# Altium schematic sheet pca20053_sheet5_sensors_and_leds.SchDoc: Thingy:53 Sensors and LEDs
size A3; Organization: Nordic Semiconductor; DocumentNumber: 5; SheetNumber: 5; SheetTotal: 6; CompanyName: Nordic Semiconductor; DocumentSize: A3
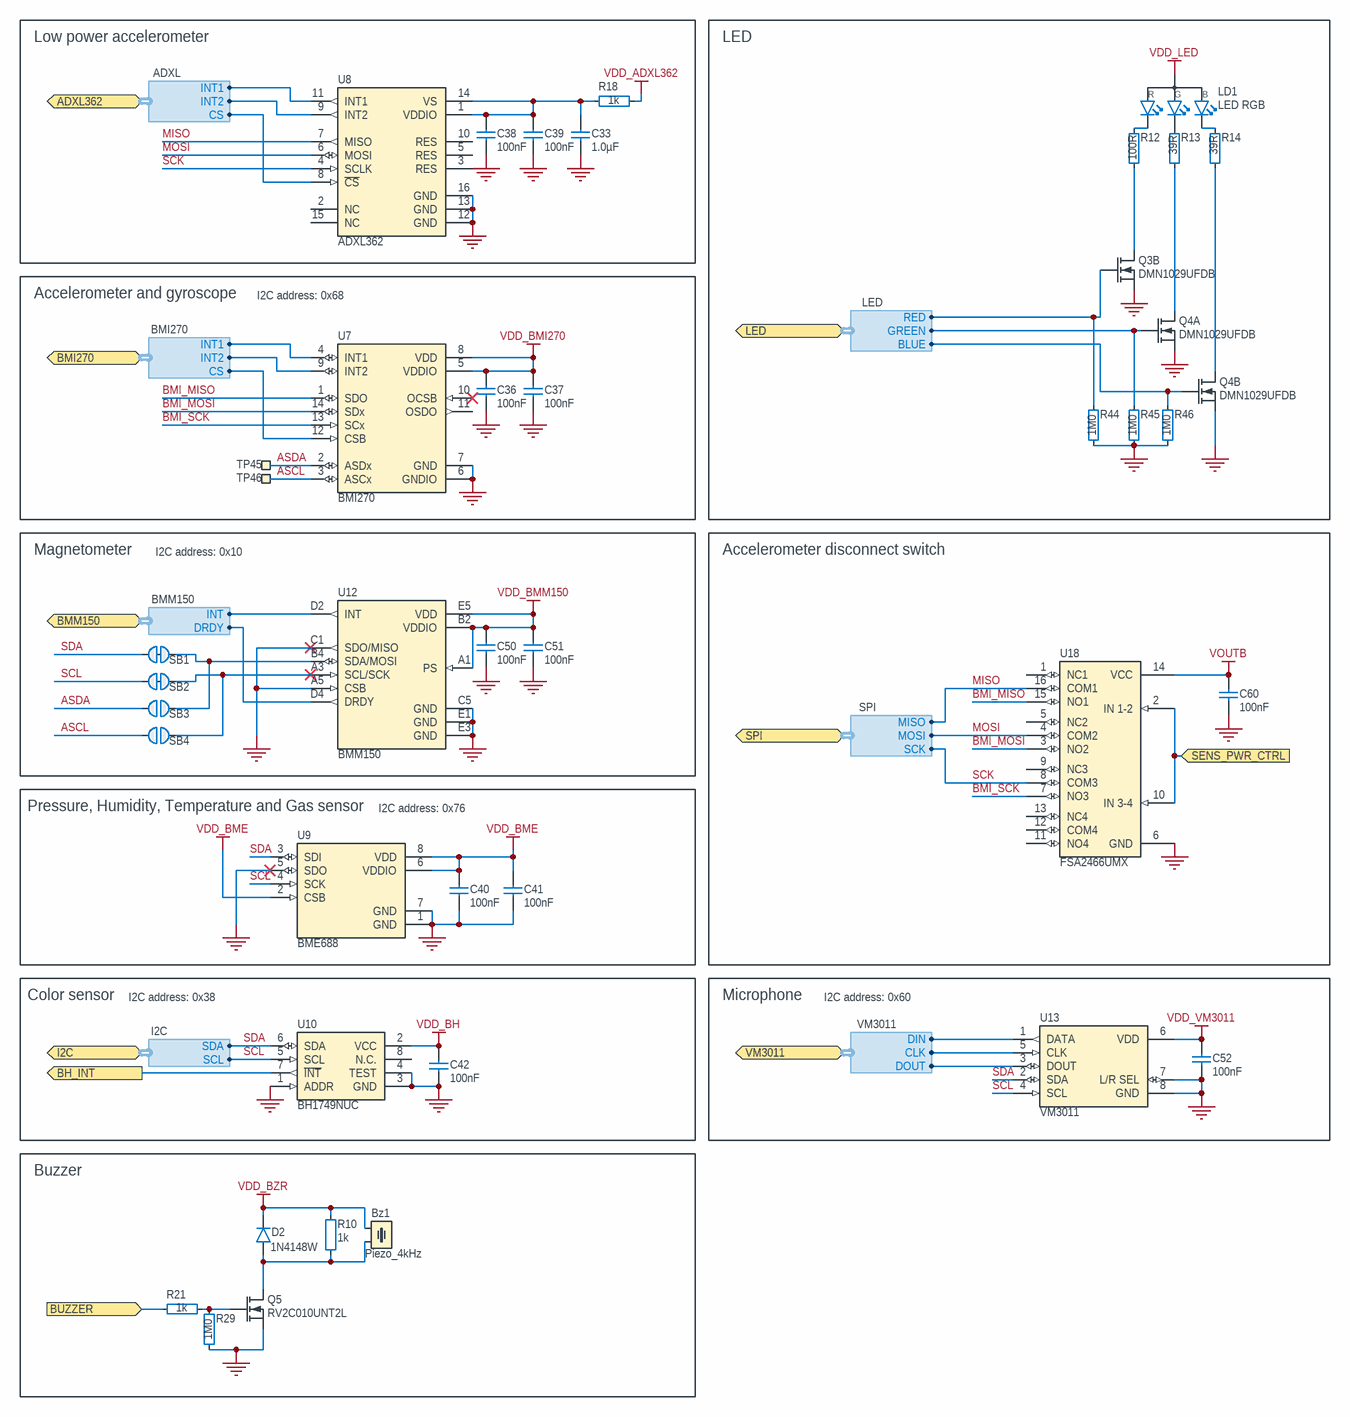
[diagram p0: pca20053_sheet5_sensors_and_leds.SchDoc]

## Parts
Bz1  Piezo_4kHz  [Buzzer_PKMCS0909]
C33  1.0µF  [CAPC1005X04L]
C36  100nF  [CAPC0603X03L_C]
C37  100nF  [CAPC0603X03L_C]
C38  100nF  [CAPC0603X03L_C]
C39  100nF  [CAPC0603X03L_C]
C40  100nF  [CAPC0603X03L_C]
C41  100nF  [CAPC0603X03L_C]
C42  100nF  [CAPC0603X03L_C]
C50  100nF  [CAPC0603X03L_C]
C51  100nF  [CAPC0603X03L_C]
C52  100nF  [CAPC0603X03L_C]
C60  100nF  [CAPC0603X03L_C]
D2  1N4148W  [SOD-123-DIODE]
LD1  LED RGB  [LED_RGB_0606]
Q3  DMN1029UFDB  [DFN65P200X60_HS-6N]  (part B of 2)
Q4  DMN1029UFDB  [DFN65P200X60_HS-6N]  (parts A,B of 2)
Q5  RV2C010UNT2L  [DFN65P100X40-3L]
R10  1k  [RESC0603X03L_C]
R12  100R  [RESC0603X03L_C]
R13  39R  [RESC0603X03L_C]
R14  39R  [RESC0603X03L_C]
R18  1k  [RESC0603X03L_C]
R21  1k  [RESC0603X03L_C]
R29  1M0  [RESC0603X03L_C]
R44  1M0  [RESC0603X03L_C]
R45  1M0  [RESC0603X03L_C]
R46  1M0  [RESC0603X03L_C]
SB1  Solderbridge  [Solderbridge_Shorted]  (value not drawn)  (net tie, no BOM)
SB2  Solderbridge  [Solderbridge_Shorted]  (value not drawn)  (net tie, no BOM)
SB3  Solderbridge  [Solderbridge]  (value not drawn)  (no BOM)
SB4  Solderbridge  [Solderbridge]  (value not drawn)  (no BOM)
TP45  Ø0.7mm,SMD  [TP_SMD_D0.7mm]  (value not drawn)  (no BOM)
TP46  Ø0.7mm,SMD  [TP_SMD_D0.7mm]  (value not drawn)  (no BOM)
U7  BMI270  [BMI270]
U8  ADXL362  [LGA50P322X300X114-16N]
U9  BME688  [BME680]
U10  BH1749NUC  [WSON50P210X210X60_HS-9N]
U12  BMM150  [BMM150]
U13  VM3011  [VM3011]
U18  FSA2466UMX  [XQFN40P180X260X50-16N]

## Blocks framed on the sheet
Low power accelerometer: C33 C38 C39 R18 U8
LED: LD1 Q3 Q4 R12-R14 R44-R46
Accelerometer and gyroscope: C36 C37 TP45 TP46 U7
Magnetometer: C50 C51 SB1-SB4 U12
Accelerometer disconnect switch: C60 U18
Pressure, Humidity, Temperature and Gas sensor: C40 C41 U9
Color sensor: C42 U10
Microphone: C52 U13
Buzzer: Bz1 D2 Q5 R10 R21 R29

## Ports
ADXL362 (bidir, harness ADXL), BH_INT (out), BMI270 (bidir, harness BMI270), BMM150 (bidir, harness BMM150), BUZZER (in), I2C (bidir, harness I2C), LED (bidir, harness LED), SENS_PWR_CTRL (in), SPI (bidir, harness SPI), VM3011 (bidir, harness VM3011)

## Harnesses
I2C: SDA, SCL
LED: BLUE, GREEN, RED
BMI270: CS, INT2, INT1
ADXL: CS, INT2, INT1
BMM150: DRDY, INT
VM3011: DIN, CLK, DOUT
SPI: MISO, MOSI, SCK

## Nets
GND: C33.1 C36.1 C37.1 C38.1 C39.1 C40.1 C41.1 C42.1 C50.1 C51.1 C52.1 C60.2 Q3.4(S2) Q4.1(S1) Q4.4(S2) Q5.2(S) R29.1 R44.1 R45.1 R46.1 U7.6(GNDIO) U7.7(GND) U8.12(GND) U8.13(GND) U8.16(GND) U9.1(GND) U9.5(SDO) U9.7(GND) U10.1(ADDR) U10.3(GND) U10.4(TEST) U10.9(GND) U12.A5(CSB) U12.C1(SDO/MISO) U12.C5(GND) U12.E1(GND) U12.E3(GND) U13.7(L/R_SEL) U13.8(GND) U18.6(GND)
VDD_ADXL362: R18.1
VDD_BH: C42.2 U10.2(VCC)
VDD_BME: C40.2 C41.2 U9.2(CSB) U9.6(VDDIO) U9.8(VDD)
VDD_BMI270: C36.2 C37.2 U7.5(VDDIO) U7.8(VDD)
VDD_BMM150: C50.2 C51.2 U12.A1(PS) U12.B2(VDDIO) U12.E5(VDD)
VDD_BZR: Bz1.1 D2.1(C) R10.2
VDD_LED: LD1.4(A)
VDD_VM3011: C52.2 U13.6(VDD)
VOUTB: C60.1 U18.14(VCC)
ASCL: SB4.1 TP46.1 U7.3(ASCx)
ASDA: SB3.1 TP45.1 U7.2(ASDx)
BH_INT: U10.7(~{INT}) ; port BH_INT
BMI_MISO: U7.1(SDO) U18.15(NO1)
BMI_MOSI: U7.14(SDx) U18.3(NO2)
BMI_SCK: U7.13(SCx) U18.7(NO3)
BUZZER: R21.1 ; port BUZZER
MISO: U8.7(MISO) U18.16(COM1) ; port SPI.MISO
MOSI: U8.6(MOSI) U18.4(COM2) ; port SPI.MOSI
SCK: U8.4(SCLK) U18.8(COM3) ; port SPI.SCK
SCL: SB2.2 U9.4(SCK) U10.5(SCL) U13.4(SCL) ; port I2C.SCL
SDA: SB1.2 U9.3(SDI) U10.6(SDA) U13.2(SDA) ; port I2C.SDA
SENS_PWR_CTRL: U18.2(IN_1-2) U18.10(IN_3-4) ; port SENS_PWR_CTRL
NetBz1_2: Bz1.2 D2.2(A) Q5.3(D) R10.1
NetC33_2: C33.2 C38.2 C39.2 R18.2 U8.1(VDDIO) U8.14(VS)
NetLD1_1: LD1.1(C_RED) R12.2
NetLD1_2: LD1.2(C_GREEN) R13.2
NetLD1_3: LD1.3(C_BLUE) R14.2
NetQ3_3: Q3.3(D2) R12.1
NetQ3_5: Q3.5(G2) R44.2 ; port LED.RED
NetQ4_2: Q4.2(G1) R45.2 ; port LED.GREEN
NetQ4_3: Q4.3(D2) R14.1
NetQ4_5: Q4.5(G2) R46.2 ; port LED.BLUE
NetQ4_6: Q4.6(D1) R13.1
NetQ5_1: Q5.1(G) R21.2 R29.2
NetSB1_1: SB1.1 SB3.2 U12.B4(SDA/MOSI)
NetSB2_1: SB2.1 SB4.2 U12.A3(SCL/SCK)
NetU7_4: U7.4(INT1) ; port BMI270.INT1
NetU7_9: U7.9(INT2) ; port BMI270.INT2
NetU7_12: U7.12(CSB) ; port BMI270.CS
NetU8_8: U8.8(~{CS}) ; port ADXL362.CS
NetU8_9: U8.9(INT2) ; port ADXL362.INT2
NetU8_11: U8.11(INT1) ; port ADXL362.INT1
NetU12_D2: U12.D2(INT) ; port BMM150.INT
NetU12_D4: U12.D4(DRDY) ; port BMM150.DRDY
NetU13_1: U13.1(DATA) ; port VM3011.DIN
NetU13_3: U13.3(DOUT) ; port VM3011.DOUT
NetU13_5: U13.5(CLK) ; port VM3011.CLK

Not connected (* = marked no-connect by the designer): U7 10(OCSB)* 11(OSDO); U8 2(NC) 3(RES) 5(RES) 10(RES) 15(NC); U10 8(N.C.); U18 1(NC1) 5(NC2) 9(NC3) 11(NO4) 12(COM4) 13(NC4)

## Notes on the sheet
- I2C address: 0x68
- I2C address: 0x10
- (near U9) I2C address: 0x76
- I2C address: 0x38
- I2C address: 0x60
- Title
- Size
- Date:
- File:
- A3
- PCB Assembly Number
- Sheet         of
- Drawn By:
- Revision
- Classification:
- (in symbol LTST-C19HE1WT) R; G; B

## Library data of the parts
Bz1 = PKMCS0909E4000-R1: Piezo Buzzer, SMD, 9.0mm x 9.0mm x 1.9mm, 4kHz, 65dB @ 1.5V, <12.5Vp-p; Manufacturer: Murata; Part number NEMS: 101000026; Note: 1.5 ~ 12.5V; Artikkelnr Noca: N.A.; Pad Count: 2; Component Status: Active; Part Number: PKMCS0909E4000-R1; Manufacturer Part Number: PKMCS0909E4000-R1; ComponentLink1URL: N.A.; ComponentLink1Description: Datasheet; ComponentLink2URL: N.A.; ComponentLink2Description: Supplier link; HelpURL: https://www.murata.com/en-global/products/productdetail.aspx?partno=PKMCS0909E4000-R1; Footprint Doc: Buzzer_PKMCS0909; LatestRevisionDate: 2020-08-04; Published: 2020-08-04; Value: Piezo_4kHz; Supplier 1: Digi-Key; Supplier Part Number 1: 490-9647-1-ND; Supplier 2: Mouser; Supplier Part Number 2: 81-PKMCS0909E4000-R1; Part number IPS: N.A.; Component Class: Transducers; PartId: 101000026; Author: rsk; Part number Norautron: N.A.
C33 = C0402-1µ0-25V-X5R: Capacitor, Ceramic, X5R, ±10%, 25V; Manufacturer: Murata; Manufacturer Part Number: GRM155R61E105KA12D; Part number NEMS: 100200453; Artikkelnr Noca: N.A.; Pad Count: 2; Component Status: Active; Part Number: C0402-1µ0-25V-X5R; LatestRevisionDate: 2020-12-16; Published: 2020-12-16; Value: 1.0µF; Footprint Doc: 0402; Component Class: Capacitors; ComponentLink1Description: Datasheet; ComponentLink1URL: https://search.murata.co.jp/Ceramy/image/img/A01X/G101/ENG/GRM155R61E105KA12-01.pdf; ComponentLink2Description: Supplier link; ComponentLink2URL: https://www.murata.com/en-global/products/productdetail?partno=GRM155R61E105KA12%23; HelpURL: N.A.; Note: 25V; PartId: 100200453; Part number IPS: N.A.; Supplier 1: Digi-Key; Supplier 2: Mouser; Supplier Part Number 1: 490-10017-1-ND; Supplier Part Number 2: 81-GRM155R61E105KA2D; Author: rsk; Part number Norautron: N.A.
C36-C42 C50-C52 C60 = C0201-100n-6.3V-X5R: Capacitor, Ceramic, X5R, ±10%, 6.3V; Manufacturer: Murata; Manufacturer Part Number: GRM033R60J104KE19D; Part number NEMS: 100200451; Artikkelnr Noca: N.A.; Pad Count: 2; Component Status: Active; Part Number: C0201-100n-6.3V-X5R; Footprint Doc: 0201; LatestRevisionDate: 2020-12-15; Published: 2020-12-15; Value: 100nF; Note: 6.3V; Part number IPS: N.A.; ComponentLink1URL: https://search.murata.co.jp/Ceramy/image/img/A01X/G101/ENG/GRM033R60J104KE19-01.pdf; ComponentLink1Description: Datasheet; ComponentLink2URL: https://www.murata.com/en-eu/products/productdetail?partno=GRM033R60J104KE19%23; ComponentLink2Description: Supplier link; HelpURL: N.A.; Supplier 1: Digi-Key; Supplier Part Number 1: 490-3167-1-ND; Supplier 2: N.A.; Supplier Part Number 2: N.A.; Component Class: Capacitors; PartId: 100200451; Author: rsk; Part number Norautron: N.A.
D2 = 1N4148W: 1N4148, Small Signal Fast Switching Diode; Manufacturer: Vishay; Manufacturer Part Number: 1N4148W-E3-08; Part number IPS: 00000001783; Part number NEMS: 101300078; Artikkelnr Noca: N.A.; Pad Count: 2; Component Status: Active; Part Number: 1N4148W; ComponentLink1URL: N.A.; ComponentLink1Description: Datasheet; ComponentLink2URL: N.A.; ComponentLink2Description: Supplier link; HelpURL: http://www.vishay.com/docs/85748/1n4148w.pdf; Footprint Doc: SOD-123; LatestRevisionDate: 2016-01-12; Published: 2011-04-21; Value: 1N4148W; Note: Small Signal Fast Switching Diode; Supplier 1: Farnell; Supplier Part Number 1: 237-7282; Supplier 2: Digi-Key; Supplier Part Number 2: 1N4148W-E3-08CT-ND; Component Class: Semiconductors; PartId: 101300078; Author: rsk; Part number Norautron: N.A.
LD1 = LTST-C19HE1WT: RGB LED 1.60 mm x 1.60 mm SMD; Manufacturer: LITEON; Part number IPS: 00000007798; Part number NEMS: 101400093; Note: N.A.; Pad Count: 4; Component Status: Active; Part Number: LTST-C19HE1WT; Manufacturer Part Number: LTST-C19HE1WT; LatestRevisionDate: 2016-09-23; Published: 2016-09-23; Value: LED RGB; Artikkelnr Noca: N.A.; Footprint Doc: LED_RGB_0606; ComponentLink1URL: N.A.; ComponentLink1Description: Datasheet; ComponentLink2URL: N.A.; ComponentLink2Description: Supplier link; HelpURL: http://optoelectronics.liteon.com/upload/download/DS22-2008-0044/S_110_LTST-C19HE1WT.pdf; Supplier 1: Digi-Key; Supplier Part Number 1: 160-2162-1-ND; Supplier 2: Mouser; Supplier Part Number 2: 859-LTST-C19HE1WT; Component Class: Optoelectronics; PartId: 101400093; Author: rsk; Part number Norautron: N.A.
Q3 Q4 = DMN1029UFDB: Dual N Ch MOFET, 5.6A, 29mOhm @ 5A, 4.5V, 1.4W; Manufacturer: Diodes Incorporated; Manufacturer Part Number: DMN1029UFDB-7; Part number NEMS: 101300175; Note: N.A.; Pad Count: 6; Component Status: Active; Part Number: DMN1029UFDB; Footprint Doc: DFN-6; LatestRevisionDate: 2020-04-29; Published: 2020-04-29; Value: DMN1029UFDB; Artikkelnr Noca: N.A.; Part number IPS: N.A.; Supplier 1: Digi-Key; Supplier Part Number 1: DMN1029UFDB-7DICT-ND; Supplier 2: Mouser; Supplier Part Number 2: 621-DMN1029UFDB-7; ComponentLink1URL: https://www.diodes.com/assets/Datasheets/DMN1029UFDB.pdf; ComponentLink1Description: Datasheet; ComponentLink2URL: N.A.; ComponentLink2Description: Supplier link; HelpURL: https://www.diodes.com/assets/Datasheets/DMN1029UFDB.pdf; Component Class: Semiconductors; PartId: 101300175; Author: rsk; Part number Norautron: N.A.
Q5 = RV2C010UNT2L: N-Channel MOSFET, 20V, 1A, 470mOhm, 400mW; Manufacturer: Rohm Semiconductor; Part number IPS: 00000009976; Part number Norautron: 26320026; Part number NEMS: 101300132; Note: N.A.; Artikkelnr Noca: 35010020; Pad Count: 3; Component Status: Active; Part Number: RV2C010UNT2L; Manufacturer Part Number: RV2C010UNT2L; Footprint Doc: DFN-3; LatestRevisionDate: 2016-08-09; Published: 2016-08-09; Value: RV2C010UNT2L; ComponentLink1URL: N.A.; ComponentLink1Description: Datasheet; ComponentLink2URL: N.A.; ComponentLink2Description: Supplier link; HelpURL: http://rohmfs.rohm.com/en/products/databook/datasheet/discrete/transistor/mosfet/rv2c010unt2l-e.pdf; Supplier 1: Digi-Key; Supplier Part Number 1: RV2C010UNT2LCT-ND; Supplier 2: Mouser; Supplier Part Number 2: 755-RV2C010UNT2L; Component Class: Semiconductors; PartId: 101300132; Author: rsk
R10 R18 R21 = R0201-1k0: Resistor, ±1%, 0.05W; Manufacturer: N.A.; Part number IPS: 00000005786; Part number NEMS: 100100043; Note: Chip Res 1%; Pad Count: 2; Component Status: Active; Part Number: R0201-1k0; Manufacturer Part Number: N.A.; ComponentLink1URL: N.A.; ComponentLink1Description: Datasheet; ComponentLink2URL: N.A.; ComponentLink2Description: Supplier link; HelpURL: N.A.; Footprint Doc: 0201; LatestRevisionDate: 2014-11-13; Published: 2014-11-13; Value: 1k; Supplier 1: N.A.; Supplier Part Number 1: N.A.; Supplier 2: N.A.; Supplier Part Number 2: N.A.; Artikkelnr Noca: N.A.; Component Class: Resistors; PartId: 100100043; Author: rsk; Part number Norautron: N.A.
R12 = R0201-100: Resistor, ±1%, 0.05W; Manufacturer: N.A.; Part number IPS: 00000001794; Part number Norautron: 26107004; Part number NEMS: 100100027; Note: Chip Res 1%; Pad Count: 2; Component Status: Active; Part Number: R0201-100; Manufacturer Part Number: N.A.; LatestRevisionDate: 2014-11-13; Published: 2014-11-13; Value: 100R; Artikkelnr Noca: N.A.; Footprint Doc: 0201; ComponentLink1URL: N.A.; ComponentLink1Description: Datasheet; ComponentLink2URL: N.A.; ComponentLink2Description: Supplier link; HelpURL: N.A.; Supplier 1: N.A.; Supplier Part Number 1: N.A.; Supplier 2: N.A.; Supplier Part Number 2: N.A.; Component Class: Resistors; PartId: 100100027; Author: rsk
R13 R14 = R0201-39R: Resistor, ±1%, 0.05W; Manufacturer: N.A.; Part number IPS: 00000001704; Part number NEMS: 100100021; Note: Chip Res 1%; Pad Count: 2; Component Status: Active; Part Number: R0201-39R; Manufacturer Part Number: N.A.; LatestRevisionDate: 2014-11-13; Published: 2014-11-13; Value: 39R; Artikkelnr Noca: N.A.; Footprint Doc: 0201; ComponentLink1URL: N.A.; ComponentLink1Description: Datasheet; ComponentLink2URL: N.A.; ComponentLink2Description: Supplier link; HelpURL: N.A.; Supplier 1: N.A.; Supplier Part Number 1: N.A.; Supplier 2: N.A.; Supplier Part Number 2: N.A.; Component Class: Resistors; PartId: 100100021; Author: rsk; Part number Norautron: N.A.
R29 = R0201-1M0: Resistor, ±1%, 0.05W; Manufacturer: N.A.; Part number IPS: 00000001418; Part number Norautron: 26107108; Part number NEMS: 100100093; Pad Count: 2; Note: Chip Res 1%; Component Status: Active; Part Number: R0201-1M0; PartId: 100100093; Component Class: Resistors; Manufacturer Part Number: N.A.; ComponentLink1URL: N.A.; ComponentLink1Description: Datasheet; ComponentLink2URL: N.A.; ComponentLink2Description: Supplier link; HelpURL: N.A.; Footprint Doc: 0201; LatestRevisionDate: 2014-11-13; Published: 2014-11-13; Value: 1M0; Supplier 1: N.A.; Supplier Part Number 1: N.A.; Supplier 2: N.A.; Supplier Part Number 2: N.A.; Artikkelnr Noca: N.A.; Author: rsk
R44-R46 = R0201-1M0: Resistor, ±1%, 0.05W; Manufacturer: N.A.; Part number IPS: 00000001418; Part number Norautron: 26107108; Part number NEMS: 100100093; Note: Chip Res 1%; Pad Count: 2; Component Status: Active; Part Number: R0201-1M0; Manufacturer Part Number: N.A.; LatestRevisionDate: 2014-11-13; Published: 2014-11-13; Value: 1M0; Artikkelnr Noca: N.A.; Footprint Doc: 0201; ComponentLink1URL: N.A.; ComponentLink1Description: Datasheet; ComponentLink2URL: N.A.; ComponentLink2Description: Supplier link; HelpURL: N.A.; Supplier 1: N.A.; Supplier Part Number 1: N.A.; Supplier 2: N.A.; Supplier Part Number 2: N.A.; Component Class: Resistors; PartId: 100100093; Author: rsk
SB1 SB2 = Solderbridge Shorted: Shorted Solderbridge; Manufacturer: N.A.; Part number NEMS: 100500459; Pad Count: 2; Component Status: Active; System: Connector; Part Number: Solderbridge Shorted; PartId: 100500459; Component Class: Connectors; Manufacturer Part Number: N.A.; ComponentLink1URL: N.A.; ComponentLink1Description: Datasheet; ComponentLink2URL: N.A.; ComponentLink2Description: Supplier link; HelpURL: N.A.; Footprint Doc: Solderbridge_Shorted; LatestRevisionDate: 2012-08-07; Published: 2012-08-07; Value: Solderbridge; Note: N.A.; Supplier 1: N.A.; Supplier Part Number 1: N.A.; Supplier 2: N.A.; Supplier Part Number 2: N.A.; Artikkelnr Noca: N.A.; Part number IPS: N.A.; Author: rsk; Part number Norautron: N.A.
SB3 SB4 = Solderbridge: Manufacturer: N.A.; Part number NEMS: 100500458; Pad Count: 2; Component Status: Active; System: Connector; Part Number: Solderbridge; PartId: 100500458; Component Class: Connectors; Manufacturer Part Number: N.A.; ComponentLink1URL: N.A.; ComponentLink1Description: Datasheet; ComponentLink2URL: N.A.; ComponentLink2Description: Supplier link; HelpURL: N.A.; Footprint Doc: Solderbridge; LatestRevisionDate: 2009-12-14; Published: 2009-12-14; Value: Solderbridge; Note: N.A.; Supplier 1: N.A.; Supplier Part Number 1: N.A.; Supplier 2: N.A.; Supplier Part Number 2: N.A.; Artikkelnr Noca: N.A.; Part number IPS: N.A.; Author: rsk; Part number Norautron: N.A.
TP45 TP46 = TP_SMD_Ø0.7MM: 0.7mm circular SMD testpad; Manufacturer: Nordic Semiconductor; Manufacturer Part Number: N.A.; Part number NEMS: 100500474; Pad Count: 1; Component Status: Active; System: Connector; Part Number: TP_SMD_Ø0.7MM; PartId: 100500474; Component Class: Connectors; ComponentLink1URL: N.A.; ComponentLink1Description: Datasheet; ComponentLink2URL: N.A.; ComponentLink2Description: Supplier link; HelpURL: N.A.; Footprint Doc: TP_SMD_Ø0.7mm; LatestRevisionDate: 2021-03-05; Published: 2017-12-14; Value: Ø0.7mm,SMD; Note: N.A.; Supplier 1: N.A.; Supplier Part Number 1: N.A.; Supplier 2: N.A.; Supplier Part Number 2: N.A.; Artikkelnr Noca: N.A.; Part number IPS: N.A.; Author: rsk; Part number Norautron: N.A.
U7 = BMI270: 6-axis, smart, low-power, inertial measurement unit; Manufacturer: Bosch; Part number NEMS: 101900620; Note: N.A.; Pad Count: 14; Component Status: Active; Part Number: BMI270; Manufacturer Part Number: BMI270; ComponentLink1URL: https://www.bosch-sensortec.com/media/boschsensortec/downloads/datasheets/bst-bmi270-ds000.pdf; ComponentLink1Description: Datasheet; ComponentLink2URL: https://www.bosch-sensortec.com/products/motion-sensors/imus/bmi270.html; ComponentLink2Description: Supplier link; HelpURL: https://www.bosch-sensortec.com/media/boschsensortec/downloads/datasheets/bst-bmi270-ds000.pdf; Footprint Doc: LGA-14; LatestRevisionDate: 2021-08-03; Published: 2020-07-07; Value: BMI270; Supplier 1: Digi-Key; Supplier Part Number 1: 828-1091-1-ND; Supplier 2: Mouser; Supplier Part Number 2: 262-BMI270; Artikkelnr Noca: N.A.; Part number IPS: N.A.; Component Class: Misc_ICs; PartId: 101900620; Author: rsk; Part number Norautron: N.A.
U8 = ADXL362: Micropower, 3-Axis, ±2 g/±4 g/±8 g Digital Output MEMS Accelerometer; Manufacturer: Analog Devices; Part number IPS: 00000001799; Part number NEMS: 101900573; Note: N.A.; Pad Count: 16; Component Status: Active; Part Number: ADXL362; Manufacturer Part Number: ADXL362; ComponentLink1URL: http://www.analog.com/media/en/technical-documentation/data-sheets/ADXL362.pdf; ComponentLink1Description: Datasheet; ComponentLink2URL: http://www.analog.com/en/products/adxl362.html; ComponentLink2Description: Supplier link; HelpURL: https://www.analog.com/media/en/technical-documentation/data-sheets/ADXL362.pdf; Footprint Doc: LGA-16; LatestRevisionDate: 2019-01-11; Published: 2019-01-11; Value: ADXL362; Supplier 1: Digi-Key; Supplier Part Number 1: ADXL362BCCZ-RL7CT-ND; Supplier 2: Mouser; Supplier Part Number 2: 584-ADXL362BCCZ-R7; Artikkelnr Noca: N.A.; Component Class: Misc_ICs; PartId: 101900573; Author: rsk; Part number Norautron: N.A.
U9 = BME688: Low power gas, pressure, temperature & humidity sensor; Manufacturer: Bosch; Part number NEMS: 101900619; Note: N.A.; Pad Count: 8; Component Status: Active; Part Number: BME688; Manufacturer Part Number: BME688; Footprint Doc: LGA-8; LatestRevisionDate: 2020-07-07; Published: 2020-07-07; Value: BME688; Artikkelnr Noca: N.A.; Part number IPS: N.A.; ComponentLink1URL: https://ae-bst.resource.bosch.com/media/_tech/media/datasheets/BST-BME680-DS001-00.pdf; ComponentLink1Description: Datasheet; ComponentLink2Description: Supplier link; HelpURL: N.A.; Supplier 1: Digi-Key; Supplier Part Number 1: N.A.; Supplier 2: N.A.; Supplier Part Number 2: N.A.; Component Class: Misc_ICs; ComponentLink2URL: N.A.; PartId: 101900619; Author: rsk; Part number Norautron: N.A.
U10 = BH1749NUC: Digital 16bit Serial Output Type Color Sensor IC; Manufacturer: Rohm Semiconductor; Part number IPS: 00000001801; Part number NEMS: 101900572; Note: N.A.; Pad Count: 8; Component Status: Active; Part Number: BH1749NUC; Manufacturer Part Number: BH1749NUC; Footprint Doc: WSON-8; LatestRevisionDate: 2019-01-11; Published: 2019-01-11; Value: BH1749NUC; Artikkelnr Noca: N.A.; ComponentLink1URL: N.A.; ComponentLink1Description: Datasheet; ComponentLink2URL: N.A.; ComponentLink2Description: Supplier link; HelpURL: https://www.rohm.com/datasheet/BH1749NUC/bh1749nuc-e; Supplier 1: Digi-Key; Supplier Part Number 1: BH1749NUC-E2CT-ND; Supplier 2: Mouser; Supplier Part Number 2: 755-BH1749NUC-E2; Component Class: Misc_ICs; PartId: 101900572; Author: rsk; Part number Norautron: N.A.
U12 = BMM150: 3-axis geomagnetic sensor; Manufacturer: Bosch; Part number NEMS: 101900621; Note: N.A.; Pad Count: 12; Component Status: Active; Part Number: BMM150; Manufacturer Part Number: BMM150; ComponentLink1URL: https://www.bosch-sensortec.com/media/boschsensortec/downloads/datasheets/bst-bmm150-ds001.pdf; ComponentLink1Description: Datasheet; ComponentLink2URL: https://www.bosch-sensortec.com/products/motion-sensors/magnetometers-bmm150/; ComponentLink2Description: Supplier link; HelpURL: https://www.bosch-sensortec.com/media/boschsensortec/downloads/datasheets/bst-bmm150-ds001.pdf; Footprint Doc: WLCSP-12; LatestRevisionDate: 2020-07-07; Published: 2020-07-07; Value: BMM150; Supplier 1: Digi-Key; Supplier Part Number 1: 828-1044-1-ND; Supplier 2: Mouser; Supplier Part Number 2: 262-BMM150; Artikkelnr Noca: N.A.; Part number IPS: N.A.; Component Class: Misc_ICs; PartId: 101900621; Author: rsk; Part number Norautron: N.A.
U13 = VM3011AB: Low-Noise PDM Digital Piezoelectric MEMS Microphone with ZeroPower Listening; Manufacturer: Vesper; Part number Norautron: 26470039; Part number NEMS: 101900623; Component Status: Active; Pad Count: 8; Note: N.A.; Part Number: VM3011AB; PartId: 101900768; Component Class: Misc_ICs; Author: rsk; Manufacturer Part Number: VM3011AB; ComponentLink1URL: N.A.; ComponentLink1Description: Datasheet; ComponentLink2URL: N.A.; ComponentLink2Description: Supplier link; HelpURL: N.A.; LatestRevisionDate: 2022-02-02; Published: 2020-02-02; Footprint Doc: VM3011; Value: VM3011; Supplier 1: Digi-Key; Supplier Part Number 1: N.A.; Supplier 2: N.A.; Supplier Part Number 2: N.A.; Artikkelnr Noca: N.A.; Part number IPS: N.A.
U18 = FSA2466UMX: Data / Audio Low-Voltage Dual DPDT Analog Switch; Manufacturer: ON Semiconductor; Part number IPS: 00000009986; Part number Norautron: 26500608; Part number NEMS: 101900422; Note: N.A.; Artikkelnr Noca: 15070069; Pad Count: 16; Component Status: Active; Part Number: FSA2466UMX; Manufacturer Part Number: FSA2466UMX; ComponentLink1URL: N.A.; ComponentLink1Description: Datasheet; ComponentLink2URL: N.A.; ComponentLink2Description: Supplier link; HelpURL: https://www.onsemi.com/pub/Collateral/FSA2466-D.PDF; Footprint Doc: UFQFN-16; LatestRevisionDate: 2019-05-15; Published: 2016-05-18; Value: FSA2466UMX; Supplier 1: Digi-Key; Supplier Part Number 1: FSA2466UMXCT-ND; Supplier 2: Mouser; Supplier Part Number 2: 512-FSA2466UMX; Component Class: Misc_ICs; PartId: 101900422; Author: rsk